# Altium project xDAC-v3.PrjPcb (part 2 of 7)

## Sheet iDAC2.SchDoc: Laser PCB
size A3; DrawnBy: James Singleton; Organization: TMC Technology Ltd.; DocumentNumber: 3; Revision: A; SheetNumber: 4; SheetTotal: 18; Drawn Date: 22/12/2020
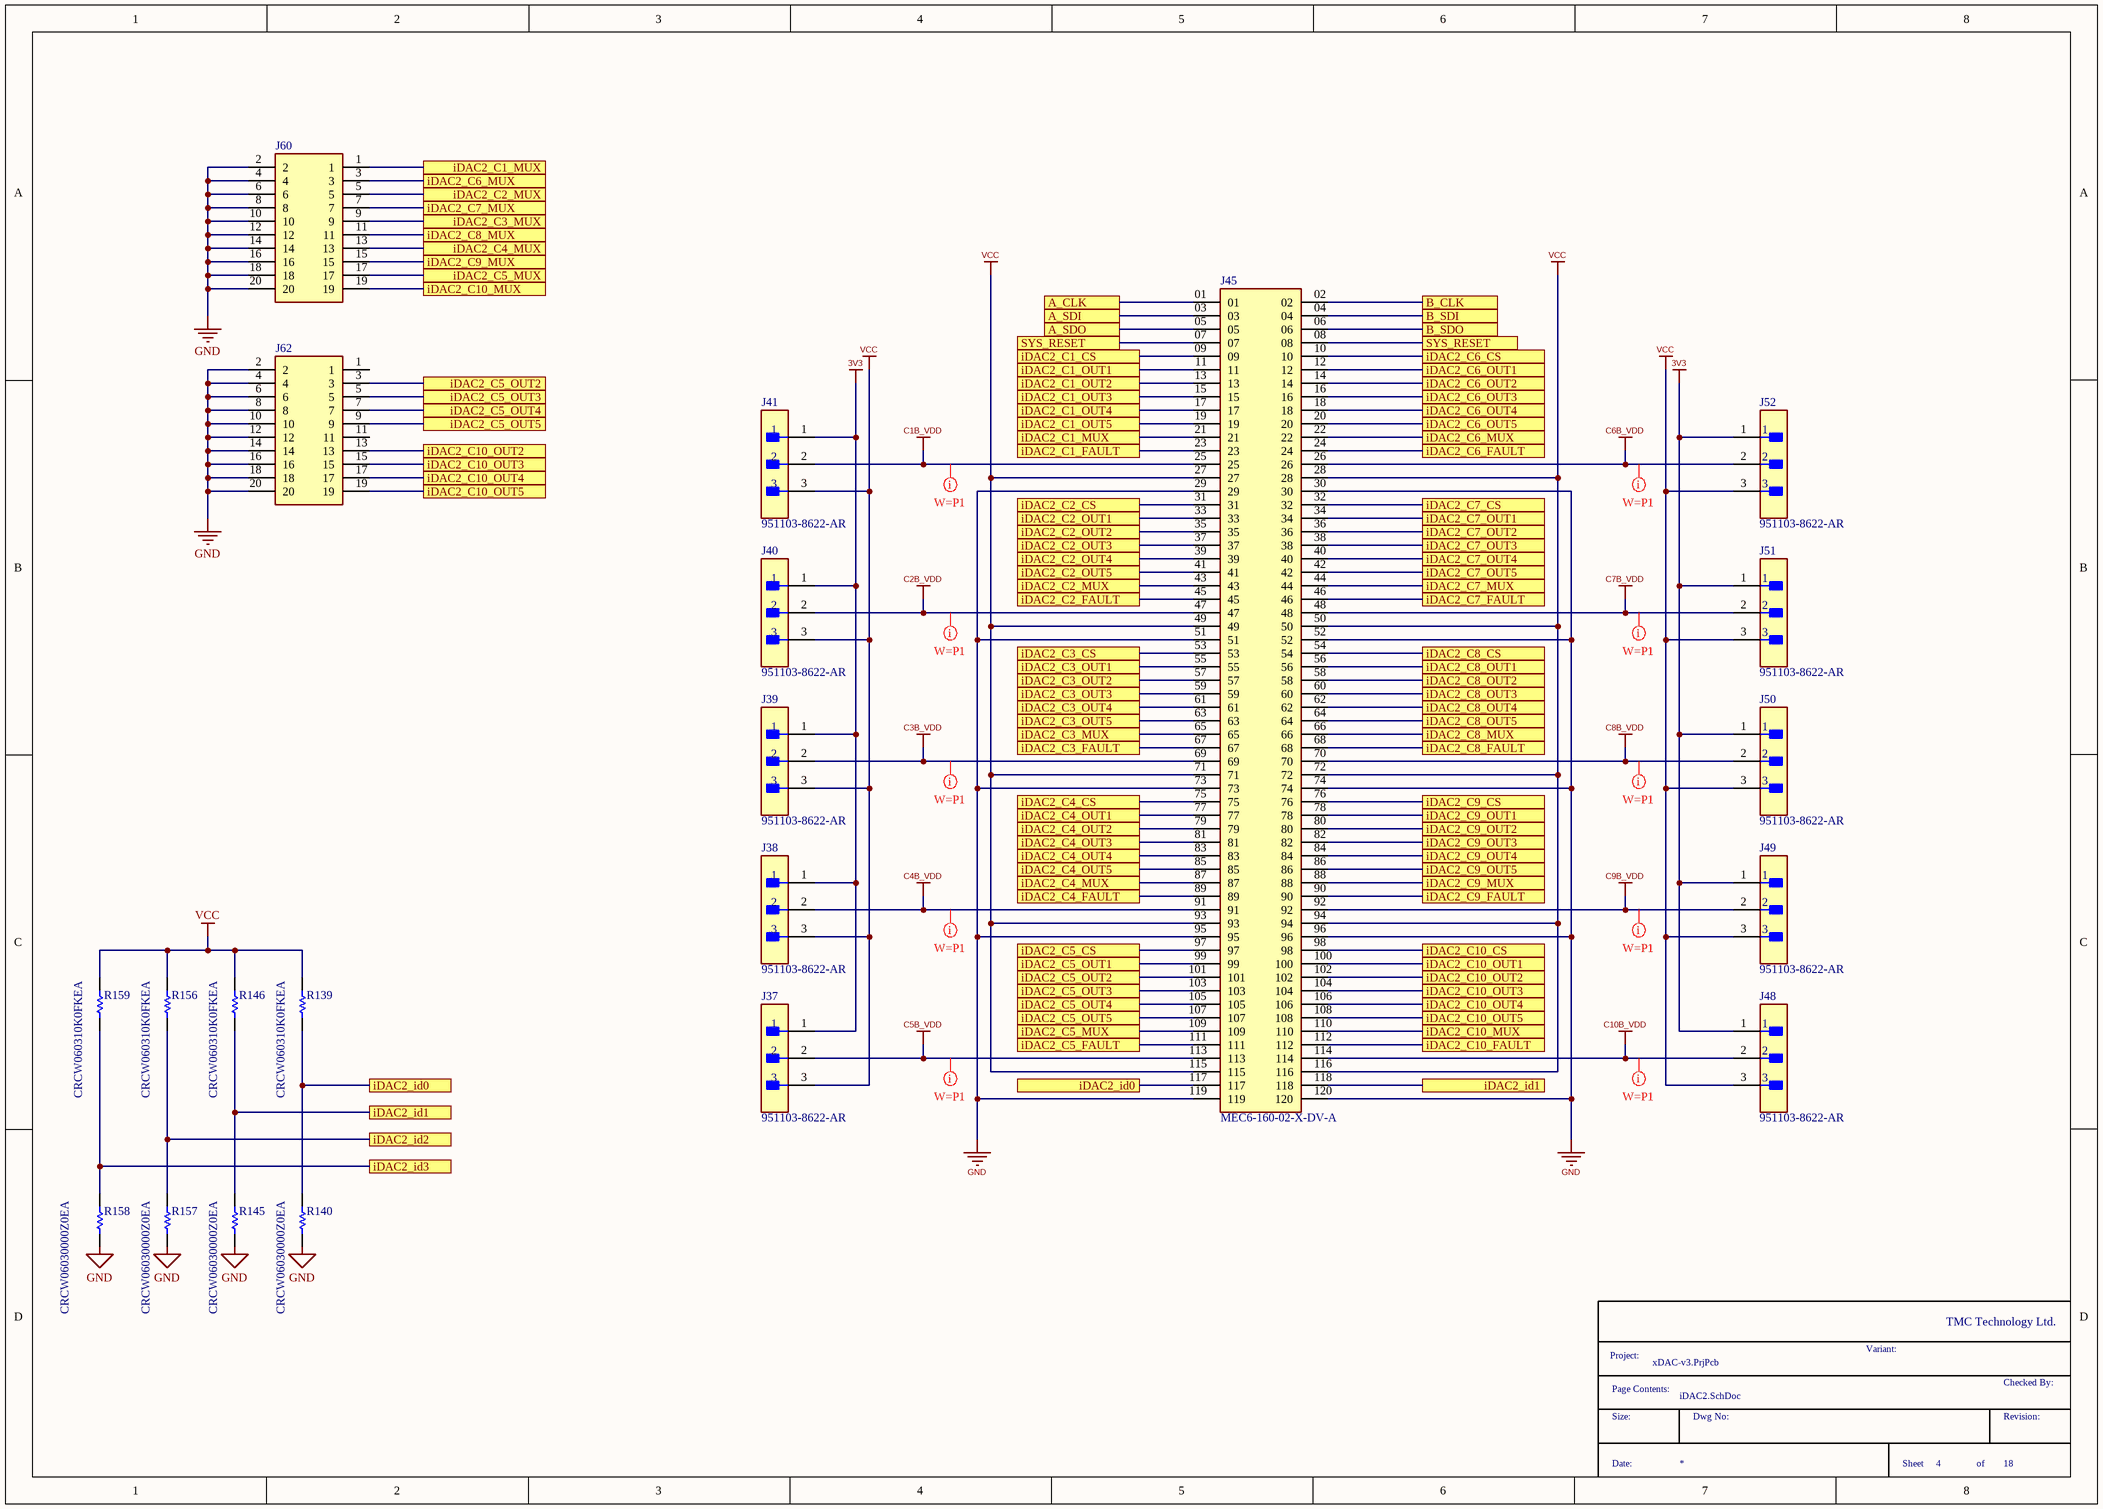
[diagram p4: iDAC2.SchDoc]

### Parts
J37  951103-8622-AR  [FP-951103-8622-AR-MFG]
J38  951103-8622-AR  [FP-951103-8622-AR-MFG]
J39  951103-8622-AR  [FP-951103-8622-AR-MFG]
J40  951103-8622-AR  [FP-951103-8622-AR-MFG]
J41  951103-8622-AR  [FP-951103-8622-AR-MFG]
J45  MEC6-160-02-X-DV-A  [SAMTEC_MEC6-160-02-X-DV-A]
J48  951103-8622-AR  [FP-951103-8622-AR-MFG]
J49  951103-8622-AR  [FP-951103-8622-AR-MFG]
J50  951103-8622-AR  [FP-951103-8622-AR-MFG]
J51  951103-8622-AR  [FP-951103-8622-AR-MFG]
J52  951103-8622-AR  [FP-951103-8622-AR-MFG]
J60  (no value)  [HDRV20W40P127_2X10_1270X340X550P]
J62  (no value)  [HDRV20W40P127_2X10_1270X340X550P]
R139  CRCW060310K0FKEA  [RESC1609X50X30NL8T20]
R140  CRCW06030000Z0EA  [RESC1609X50X30NL8T20]
R145  CRCW06030000Z0EA  [RESC1609X50X30NL8T20]
R146  CRCW060310K0FKEA  [RESC1609X50X30NL8T20]
R156  CRCW060310K0FKEA  [RESC1609X50X30NL8T20]
R157  CRCW06030000Z0EA  [RESC1609X50X30NL8T20]
R158  CRCW06030000Z0EA  [RESC1609X50X30NL8T20]
R159  CRCW060310K0FKEA  [RESC1609X50X30NL8T20]

### Ports
A_CLK (see iDAC1[4A], PI_INTERFACE[2B], vDAC1[4A], vDAC2[4A]), A_SDI (see iDAC1[4A], PI_INTERFACE[2B], vDAC1[4A], vDAC2[4A]), A_SDO (see iDAC1[4A], PI_INTERFACE[1B], vDAC1[4A], vDAC2[4A]), B_CLK (see iDAC1[6A], PI_INTERFACE[2B], vDAC1[5A], vDAC2[5A]), B_SDI (see iDAC1[6A], PI_INTERFACE[2B], vDAC1[5A], vDAC2[5A]), B_SDO (see iDAC1[6A], PI_INTERFACE[1B], vDAC1[5A], vDAC2[5A]), iDAC2_C1_CS (see ChipSelects+Faults[6B]), iDAC2_C1_FAULT (see ChipSelects+Faults[4B]), iDAC2_C1_MUX (see iDAC2[2A]), iDAC2_C1_MUX (see iDAC2[4B]), iDAC2_C1_OUT1 (see RX_FlexiConnectors[2C]), iDAC2_C1_OUT2 (see RX_FlexiConnectors[2C]), iDAC2_C1_OUT3 (see RX_FlexiConnectors[2C]), iDAC2_C1_OUT4 (see RX_FlexiConnectors[2C]), iDAC2_C1_OUT5 (see RX_FlexiConnectors[2C]), iDAC2_C2_CS (see ChipSelects+Faults[6B]), iDAC2_C2_FAULT (see ChipSelects+Faults[1B]), iDAC2_C2_MUX (see iDAC2[2A]), iDAC2_C2_MUX (see iDAC2[4B]), iDAC2_C2_OUT1 (see RX_FlexiConnectors[2C]), iDAC2_C2_OUT2 (see RX_FlexiConnectors[2C]), iDAC2_C2_OUT3 (see RX_FlexiConnectors[2C]), iDAC2_C2_OUT4 (see RX_FlexiConnectors[2C]), iDAC2_C2_OUT5 (see RX_FlexiConnectors[2C]), iDAC2_C3_CS (see ChipSelects+Faults[6C]), iDAC2_C3_FAULT (see ChipSelects+Faults[1B]), iDAC2_C3_MUX (see iDAC2[2A]), iDAC2_C3_MUX (see iDAC2[4B]), iDAC2_C3_OUT1 (see RX_FlexiConnectors[2C]), iDAC2_C3_OUT2 (see RX_FlexiConnectors[2C]), iDAC2_C3_OUT3 (see RX_FlexiConnectors[2C]), iDAC2_C3_OUT4 (see RX_FlexiConnectors[2C]), iDAC2_C3_OUT5 (see RX_FlexiConnectors[2C]), iDAC2_C4_CS (see ChipSelects+Faults[6C]), iDAC2_C4_FAULT (see ChipSelects+Faults[1B]), iDAC2_C4_MUX (see iDAC2[2A]), iDAC2_C4_MUX (see iDAC2[4C]), iDAC2_C4_OUT1 (see RX_FlexiConnectors[2C]), iDAC2_C4_OUT2 (see RX_FlexiConnectors[2C]), iDAC2_C4_OUT3 (see RX_FlexiConnectors[2B]), iDAC2_C4_OUT4 (see RX_FlexiConnectors[2B]), iDAC2_C4_OUT5 (see RX_FlexiConnectors[2B]), iDAC2_C5_CS (see ChipSelects+Faults[6C]), iDAC2_C5_FAULT (see ChipSelects+Faults[1C]), iDAC2_C5_MUX (see iDAC2[2A]), iDAC2_C5_MUX (see iDAC2[4C]), iDAC2_C5_OUT1 (see RX_FlexiConnectors[2B]), iDAC2_C5_OUT2 (see iDAC2[2B]), iDAC2_C5_OUT2 (see iDAC2[4C]), iDAC2_C5_OUT3 (see iDAC2[2B]), iDAC2_C5_OUT3 (see iDAC2[4C]), iDAC2_C5_OUT4 (see iDAC2[2B]), iDAC2_C5_OUT4 (see iDAC2[4C]), iDAC2_C5_OUT5 (see iDAC2[2B]), iDAC2_C5_OUT5 (see iDAC2[4C]), iDAC2_C6_CS (see ChipSelects+Faults[6C]), iDAC2_C6_FAULT (see ChipSelects+Faults[1C]), iDAC2_C6_MUX (see iDAC2[2A]), iDAC2_C6_MUX (see iDAC2[6B]), iDAC2_C6_OUT1 (see RX_FlexiConnectors[6C]), iDAC2_C6_OUT2 (see RX_FlexiConnectors[6C]), iDAC2_C6_OUT3 (see RX_FlexiConnectors[6C]), iDAC2_C6_OUT4 (see RX_FlexiConnectors[6C]), iDAC2_C6_OUT5 (see RX_FlexiConnectors[6C]), iDAC2_C7_CS (see ChipSelects+Faults[6C]), iDAC2_C7_FAULT (see ChipSelects+Faults[1C]), iDAC2_C7_MUX (see iDAC2[2A]), iDAC2_C7_MUX (see iDAC2[6B]), iDAC2_C7_OUT1 (see RX_FlexiConnectors[6C]), iDAC2_C7_OUT2 (see RX_FlexiConnectors[6C]), iDAC2_C7_OUT3 (see RX_FlexiConnectors[6C]), iDAC2_C7_OUT4 (see RX_FlexiConnectors[6C]), iDAC2_C7_OUT5 (see RX_FlexiConnectors[6C]), iDAC2_C8_CS (see ChipSelects+Faults[6C]), iDAC2_C8_FAULT (see ChipSelects+Faults[1C]), iDAC2_C8_MUX (see iDAC2[2A]), iDAC2_C8_MUX (see iDAC2[6B]), iDAC2_C8_OUT1 (see RX_FlexiConnectors[6C]), iDAC2_C8_OUT2 (see RX_FlexiConnectors[6C]), iDAC2_C8_OUT3 (see RX_FlexiConnectors[6C]), iDAC2_C8_OUT4 (see RX_FlexiConnectors[6C]), iDAC2_C8_OUT5 (see RX_FlexiConnectors[6C]), iDAC2_C9_CS (see ChipSelects+Faults[6C]), iDAC2_C9_FAULT (see ChipSelects+Faults[4C]), iDAC2_C9_MUX (see iDAC2[2A]), iDAC2_C9_MUX (see iDAC2[6C]), iDAC2_C9_OUT1 (see RX_FlexiConnectors[6C]), iDAC2_C9_OUT2 (see RX_FlexiConnectors[6C]), iDAC2_C9_OUT3 (see RX_FlexiConnectors[6B]), iDAC2_C9_OUT4 (see RX_FlexiConnectors[6B]), iDAC2_C9_OUT5 (see RX_FlexiConnectors[6B]), iDAC2_C10_CS (see ChipSelects+Faults[6C]), iDAC2_C10_FAULT (see ChipSelects+Faults[1C]), iDAC2_C10_MUX (see iDAC2[2A]), iDAC2_C10_MUX (see iDAC2[6C]), iDAC2_C10_OUT1 (see RX_FlexiConnectors[6B]), iDAC2_C10_OUT2 (see iDAC2[2B]), iDAC2_C10_OUT2 (see iDAC2[6C]), iDAC2_C10_OUT3 (see iDAC2[2B]), iDAC2_C10_OUT3 (see iDAC2[6C]), iDAC2_C10_OUT4 (see iDAC2[2B]), iDAC2_C10_OUT4 (see iDAC2[6C]), iDAC2_C10_OUT5 (see iDAC2[2B]), iDAC2_C10_OUT5 (see iDAC2[6C]), iDAC2_id0 (see ChipSelects+Faults[1C], iDAC2[2C]), iDAC2_id0 (see ChipSelects+Faults[1C], iDAC2[4C]), iDAC2_id1 (see iDAC2[2C]), iDAC2_id1 (see iDAC2[6C]), iDAC2_id2, iDAC2_id3, SYS_RESET (see iDAC1[4A], iDAC1[6A], iDAC2[4A], PI_INTERFACE[1C], PIO[5A], PIO[5D], PIO[7B], PIO[7C], vDAC1[4A], vDAC1[5A], vDAC2[3A], vDAC2[5A]), SYS_RESET (see iDAC1[4A], iDAC1[6A], iDAC2[6A], PI_INTERFACE[1C], PIO[5A], PIO[5D], PIO[7B], PIO[7C], vDAC1[4A], vDAC1[5A], vDAC2[3A], vDAC2[5A])

### Nets
3V3: J37.1 J38.1 J39.1 J40.1 J41.1 J48.1 J49.1 J50.1 J51.1 J52.1
C1B_VDD: J41.2 J45.25
C2B_VDD: J40.2 J45.47
C3B_VDD: J39.2 J45.69
C4B_VDD: J38.2 J45.91
C5B_VDD: J37.2 J45.113
C6B_VDD: J45.26 J52.2
C7B_VDD: J45.48 J51.2
C8B_VDD: J45.70 J50.2
C9B_VDD: J45.92 J49.2
C10B_VDD: J45.114 J48.2
GND: J45.29 J45.30 J45.51 J45.52 J45.73 J45.74 J45.95 J45.96 J45.119 J45.120 J60.2 J60.4 J60.6 J60.8 J60.10 J60.12 J60.14 J60.16 J60.18 J60.20 J62.2 J62.4 J62.6 J62.8 J62.10 J62.12 J62.14 J62.16 J62.18 J62.20 R140.1 R145.1 R157.1 R158.1
VCC: J37.3 J38.3 J39.3 J40.3 J41.3 J45.27 J45.28 J45.49 J45.50 J45.71 J45.72 J45.93 J45.94 J45.115 J45.116 J48.3 J49.3 J50.3 J51.3 J52.3 R139.2 R146.2 R156.2 R159.2
A_CLK: J45.01 ; port A_CLK
A_SDI: J45.03 ; port A_SDI
A_SDO: J45.05 ; port A_SDO
B_CLK: J45.02 ; port B_CLK
B_SDI: J45.04 ; port B_SDI
B_SDO: J45.06 ; port B_SDO
iDAC2_C1_CS: J45.09 ; port iDAC2_C1_CS
iDAC2_C1_FAULT: J45.23 ; port iDAC2_C1_FAULT
iDAC2_C1_MUX: J45.21 J60.1 ; port iDAC2_C1_MUX
iDAC2_C1_OUT1: J45.11 ; port iDAC2_C1_OUT1
iDAC2_C1_OUT2: J45.13 ; port iDAC2_C1_OUT2
iDAC2_C1_OUT3: J45.15 ; port iDAC2_C1_OUT3
iDAC2_C1_OUT4: J45.17 ; port iDAC2_C1_OUT4
iDAC2_C1_OUT5: J45.19 ; port iDAC2_C1_OUT5
iDAC2_C2_CS: J45.31 ; port iDAC2_C2_CS
iDAC2_C2_FAULT: J45.45 ; port iDAC2_C2_FAULT
iDAC2_C2_MUX: J45.43 J60.5 ; port iDAC2_C2_MUX
iDAC2_C2_OUT1: J45.33 ; port iDAC2_C2_OUT1
iDAC2_C2_OUT2: J45.35 ; port iDAC2_C2_OUT2
iDAC2_C2_OUT3: J45.37 ; port iDAC2_C2_OUT3
iDAC2_C2_OUT4: J45.39 ; port iDAC2_C2_OUT4
iDAC2_C2_OUT5: J45.41 ; port iDAC2_C2_OUT5
iDAC2_C3_CS: J45.53 ; port iDAC2_C3_CS
iDAC2_C3_FAULT: J45.67 ; port iDAC2_C3_FAULT
iDAC2_C3_MUX: J45.65 J60.9 ; port iDAC2_C3_MUX
iDAC2_C3_OUT1: J45.55 ; port iDAC2_C3_OUT1
iDAC2_C3_OUT2: J45.57 ; port iDAC2_C3_OUT2
iDAC2_C3_OUT3: J45.59 ; port iDAC2_C3_OUT3
iDAC2_C3_OUT4: J45.61 ; port iDAC2_C3_OUT4
iDAC2_C3_OUT5: J45.63 ; port iDAC2_C3_OUT5
iDAC2_C4_CS: J45.75 ; port iDAC2_C4_CS
iDAC2_C4_FAULT: J45.89 ; port iDAC2_C4_FAULT
iDAC2_C4_MUX: J45.87 J60.13 ; port iDAC2_C4_MUX
iDAC2_C4_OUT1: J45.77 ; port iDAC2_C4_OUT1
iDAC2_C4_OUT2: J45.79 ; port iDAC2_C4_OUT2
iDAC2_C4_OUT3: J45.81 ; port iDAC2_C4_OUT3
iDAC2_C4_OUT4: J45.83 ; port iDAC2_C4_OUT4
iDAC2_C4_OUT5: J45.85 ; port iDAC2_C4_OUT5
iDAC2_C5_CS: J45.97 ; port iDAC2_C5_CS
iDAC2_C5_FAULT: J45.111 ; port iDAC2_C5_FAULT
iDAC2_C5_MUX: J45.109 J60.17 ; port iDAC2_C5_MUX
iDAC2_C5_OUT1: J45.99 ; port iDAC2_C5_OUT1
iDAC2_C5_OUT2: J45.101 J62.3 ; port iDAC2_C5_OUT2
iDAC2_C5_OUT3: J45.103 J62.5 ; port iDAC2_C5_OUT3
iDAC2_C5_OUT4: J45.105 J62.7 ; port iDAC2_C5_OUT4
iDAC2_C5_OUT5: J45.107 J62.9 ; port iDAC2_C5_OUT5
iDAC2_C6_CS: J45.10 ; port iDAC2_C6_CS
iDAC2_C6_FAULT: J45.24 ; port iDAC2_C6_FAULT
iDAC2_C6_MUX: J45.22 J60.3 ; port iDAC2_C6_MUX
iDAC2_C6_OUT1: J45.12 ; port iDAC2_C6_OUT1
iDAC2_C6_OUT2: J45.14 ; port iDAC2_C6_OUT2
iDAC2_C6_OUT3: J45.16 ; port iDAC2_C6_OUT3
iDAC2_C6_OUT4: J45.18 ; port iDAC2_C6_OUT4
iDAC2_C6_OUT5: J45.20 ; port iDAC2_C6_OUT5
iDAC2_C7_CS: J45.32 ; port iDAC2_C7_CS
iDAC2_C7_FAULT: J45.46 ; port iDAC2_C7_FAULT
iDAC2_C7_MUX: J45.44 J60.7 ; port iDAC2_C7_MUX
iDAC2_C7_OUT1: J45.34 ; port iDAC2_C7_OUT1
iDAC2_C7_OUT2: J45.36 ; port iDAC2_C7_OUT2
iDAC2_C7_OUT3: J45.38 ; port iDAC2_C7_OUT3
iDAC2_C7_OUT4: J45.40 ; port iDAC2_C7_OUT4
iDAC2_C7_OUT5: J45.42 ; port iDAC2_C7_OUT5
iDAC2_C8_CS: J45.54 ; port iDAC2_C8_CS
iDAC2_C8_FAULT: J45.68 ; port iDAC2_C8_FAULT
iDAC2_C8_MUX: J45.66 J60.11 ; port iDAC2_C8_MUX
iDAC2_C8_OUT1: J45.56 ; port iDAC2_C8_OUT1
iDAC2_C8_OUT2: J45.58 ; port iDAC2_C8_OUT2
iDAC2_C8_OUT3: J45.60 ; port iDAC2_C8_OUT3
iDAC2_C8_OUT4: J45.62 ; port iDAC2_C8_OUT4
iDAC2_C8_OUT5: J45.64 ; port iDAC2_C8_OUT5
iDAC2_C9_CS: J45.76 ; port iDAC2_C9_CS
iDAC2_C9_FAULT: J45.90 ; port iDAC2_C9_FAULT
iDAC2_C9_MUX: J45.88 J60.15 ; port iDAC2_C9_MUX
iDAC2_C9_OUT1: J45.78 ; port iDAC2_C9_OUT1
iDAC2_C9_OUT2: J45.80 ; port iDAC2_C9_OUT2
iDAC2_C9_OUT3: J45.82 ; port iDAC2_C9_OUT3
iDAC2_C9_OUT4: J45.84 ; port iDAC2_C9_OUT4
iDAC2_C9_OUT5: J45.86 ; port iDAC2_C9_OUT5
iDAC2_C10_CS: J45.98 ; port iDAC2_C10_CS
iDAC2_C10_FAULT: J45.112 ; port iDAC2_C10_FAULT
iDAC2_C10_MUX: J45.110 J60.19 ; port iDAC2_C10_MUX
iDAC2_C10_OUT1: J45.100 ; port iDAC2_C10_OUT1
iDAC2_C10_OUT2: J45.102 J62.13 ; port iDAC2_C10_OUT2
iDAC2_C10_OUT3: J45.104 J62.15 ; port iDAC2_C10_OUT3
iDAC2_C10_OUT4: J45.106 J62.17 ; port iDAC2_C10_OUT4
iDAC2_C10_OUT5: J45.108 J62.19 ; port iDAC2_C10_OUT5
iDAC2_id0: J45.117 R139.1 R140.2 ; port iDAC2_id0
iDAC2_id1: J45.118 R145.2 R146.1 ; port iDAC2_id1
iDAC2_id2: R156.1 R157.2 ; port iDAC2_id2
iDAC2_id3: R158.2 R159.1 ; port iDAC2_id3
SYS_RESET: J45.07 J45.08 ; port SYS_RESET

Not connected (* = marked no-connect by the designer): J62 1 11

### Layout directives
mark named W=P1: C1B_VDD, C2B_VDD, C3B_VDD, C4B_VDD, C5B_VDD, C6B_VDD, C7B_VDD, C8B_VDD, C9B_VDD, C10B_VDD

### Notes on the sheet
- TMC Technology Ltd.
- Page Contents:
- Project:
- Variant:
- Checked By:
- Size:
- Date:
- Dwg No:
- Sheet
- of
- Revision:

### Library data of the parts
J37-J41 J48-J52 = CMP-05379-000003-1: as J25 on sheet iDAC1; Height: 6.3mm; Digikey Description: CONN HEADER VERT 3POS 2MM; Device Class L3: unset; Category: Conn; Manufacturer Part Number: 951103-8622-AR; RoHS: TRUE; Contact Material: Gold,Nickel; ComponentLink2Description: Datasheet; Temperature Range Low: -55°C; Device Class L1: Connectors; Pitch: 2mm; Mouser Description: Header; PinStrip; CopperAlloy; HighTempThermoplastic; 3Cnts; 1A; RtAngle; 951Series; Octopart: https://octopart.com/951103-8622-ar-3m-14400669; Package: 951103-8622-AR; Lead Free: Yes; Device Class L2: Headers and Wire Housings; Temperature Range High: +125°C; ComponentLink2URL: http://multimedia.3m.com/mws/media/1400506O/3m-pin-strip-header-951-series-78-5100-2653-3.pdf; Automotive: No; Temperature: -55°C to +125°C; Number Of Rows: 1
J45 = MEC6-160-02-X-DV-A: MF: Samtec Inc.; System: Connector; Value: *; Price: None; Package: None; Availability: Unavailable; MP: MEC6-160-02-X-DV-A
J60 J62 = 20021111-00020T4LF: Connector; Manufacturer_Name: FCI Electronics; Datasheet Link: https://media.digikey.com/pdf/Data%20Sheets/FCI%20PDFs/Minitek%20127_Catalog.pdf; Height: 5.5mm; Manufacturer_Part_Number: 20021111-00020T4LF
R139 R146 R156 R159 = CMP-1666-00005-4: Chip Resistor, 10 KOhm, +/- 1%, 100 mW, -55 to 155 degC, 0603 (1608 Metric), RoHS, Tape and Reel; Manufacturer: Vishay Semiconductor; Voltage Rating: 75 V; Max Operating Temperature: 155 degC; PackageDescription: 2-Pin Surface Mount Device, Body 1.575 x 0.85 mm; ComponentLink1Description: Manufacturer URL; RoHSCompliant: true; PackageReference: 0603; REACH SVHC: Unknown; Length: 1.55 mm; DatasheetVersion: 06/2012; Packaging: Tape and Reel; Min Operating Temperature: -55 degC; Mounting Technology: Surface Mount; ComponentLink2URL: https://datasheet.ciiva.com/11809/0900766b80d98afc-11809037.pdf; Height: 0.45 mm; ComponentLink2Description: Datasheet; Package Quantity: 5000; ComponentLink1URL: http://www.vishay.com/
R140 R145 R157 R158 = CMP-2000-03816-5: Chip Resistor, 0 Ohm, Jumper, 100 mW, -55 to 155 degC, 0603 (1608 Metric), RoHS, Tape and Reel; Manufacturer: Vishay Semiconductor; Voltage Rating: 75 V; Package Quantity: 5000; DatasheetVersion: 06/2012; Min Operating Temperature: -55 degC; ComponentLink1URL: http://www.vishay.com/; Mounting Technology: Surface Mount; Height: 0.45 mm; ComponentLink1Description: Manufacturer URL; REACH SVHC: Unknown; PackageReference: 0603; Packaging: Tape and Reel; Max Operating Temperature: 155 degC; Mount: Surface Mount; ComponentLink2Description: Datasheet; PackageDescription: 2-Pin Surface Mount Device, Body 1.575 x 0.85 mm; Length: 1.55 mm; ComponentLink2URL: http://www.vishay.com/docs/20035/dcrcwe3.pdf; Pins: 2; RoHSCompliant: true

## Sheet LIM+LEDS+POWER.SchDoc: Laser PCB
size A3; DrawnBy: James Singleton; Organization: TMC Technology Ltd.; DocumentNumber: 5; Revision: A; SheetNumber: 5; SheetTotal: 18; Drawn Date: 22/12/2020
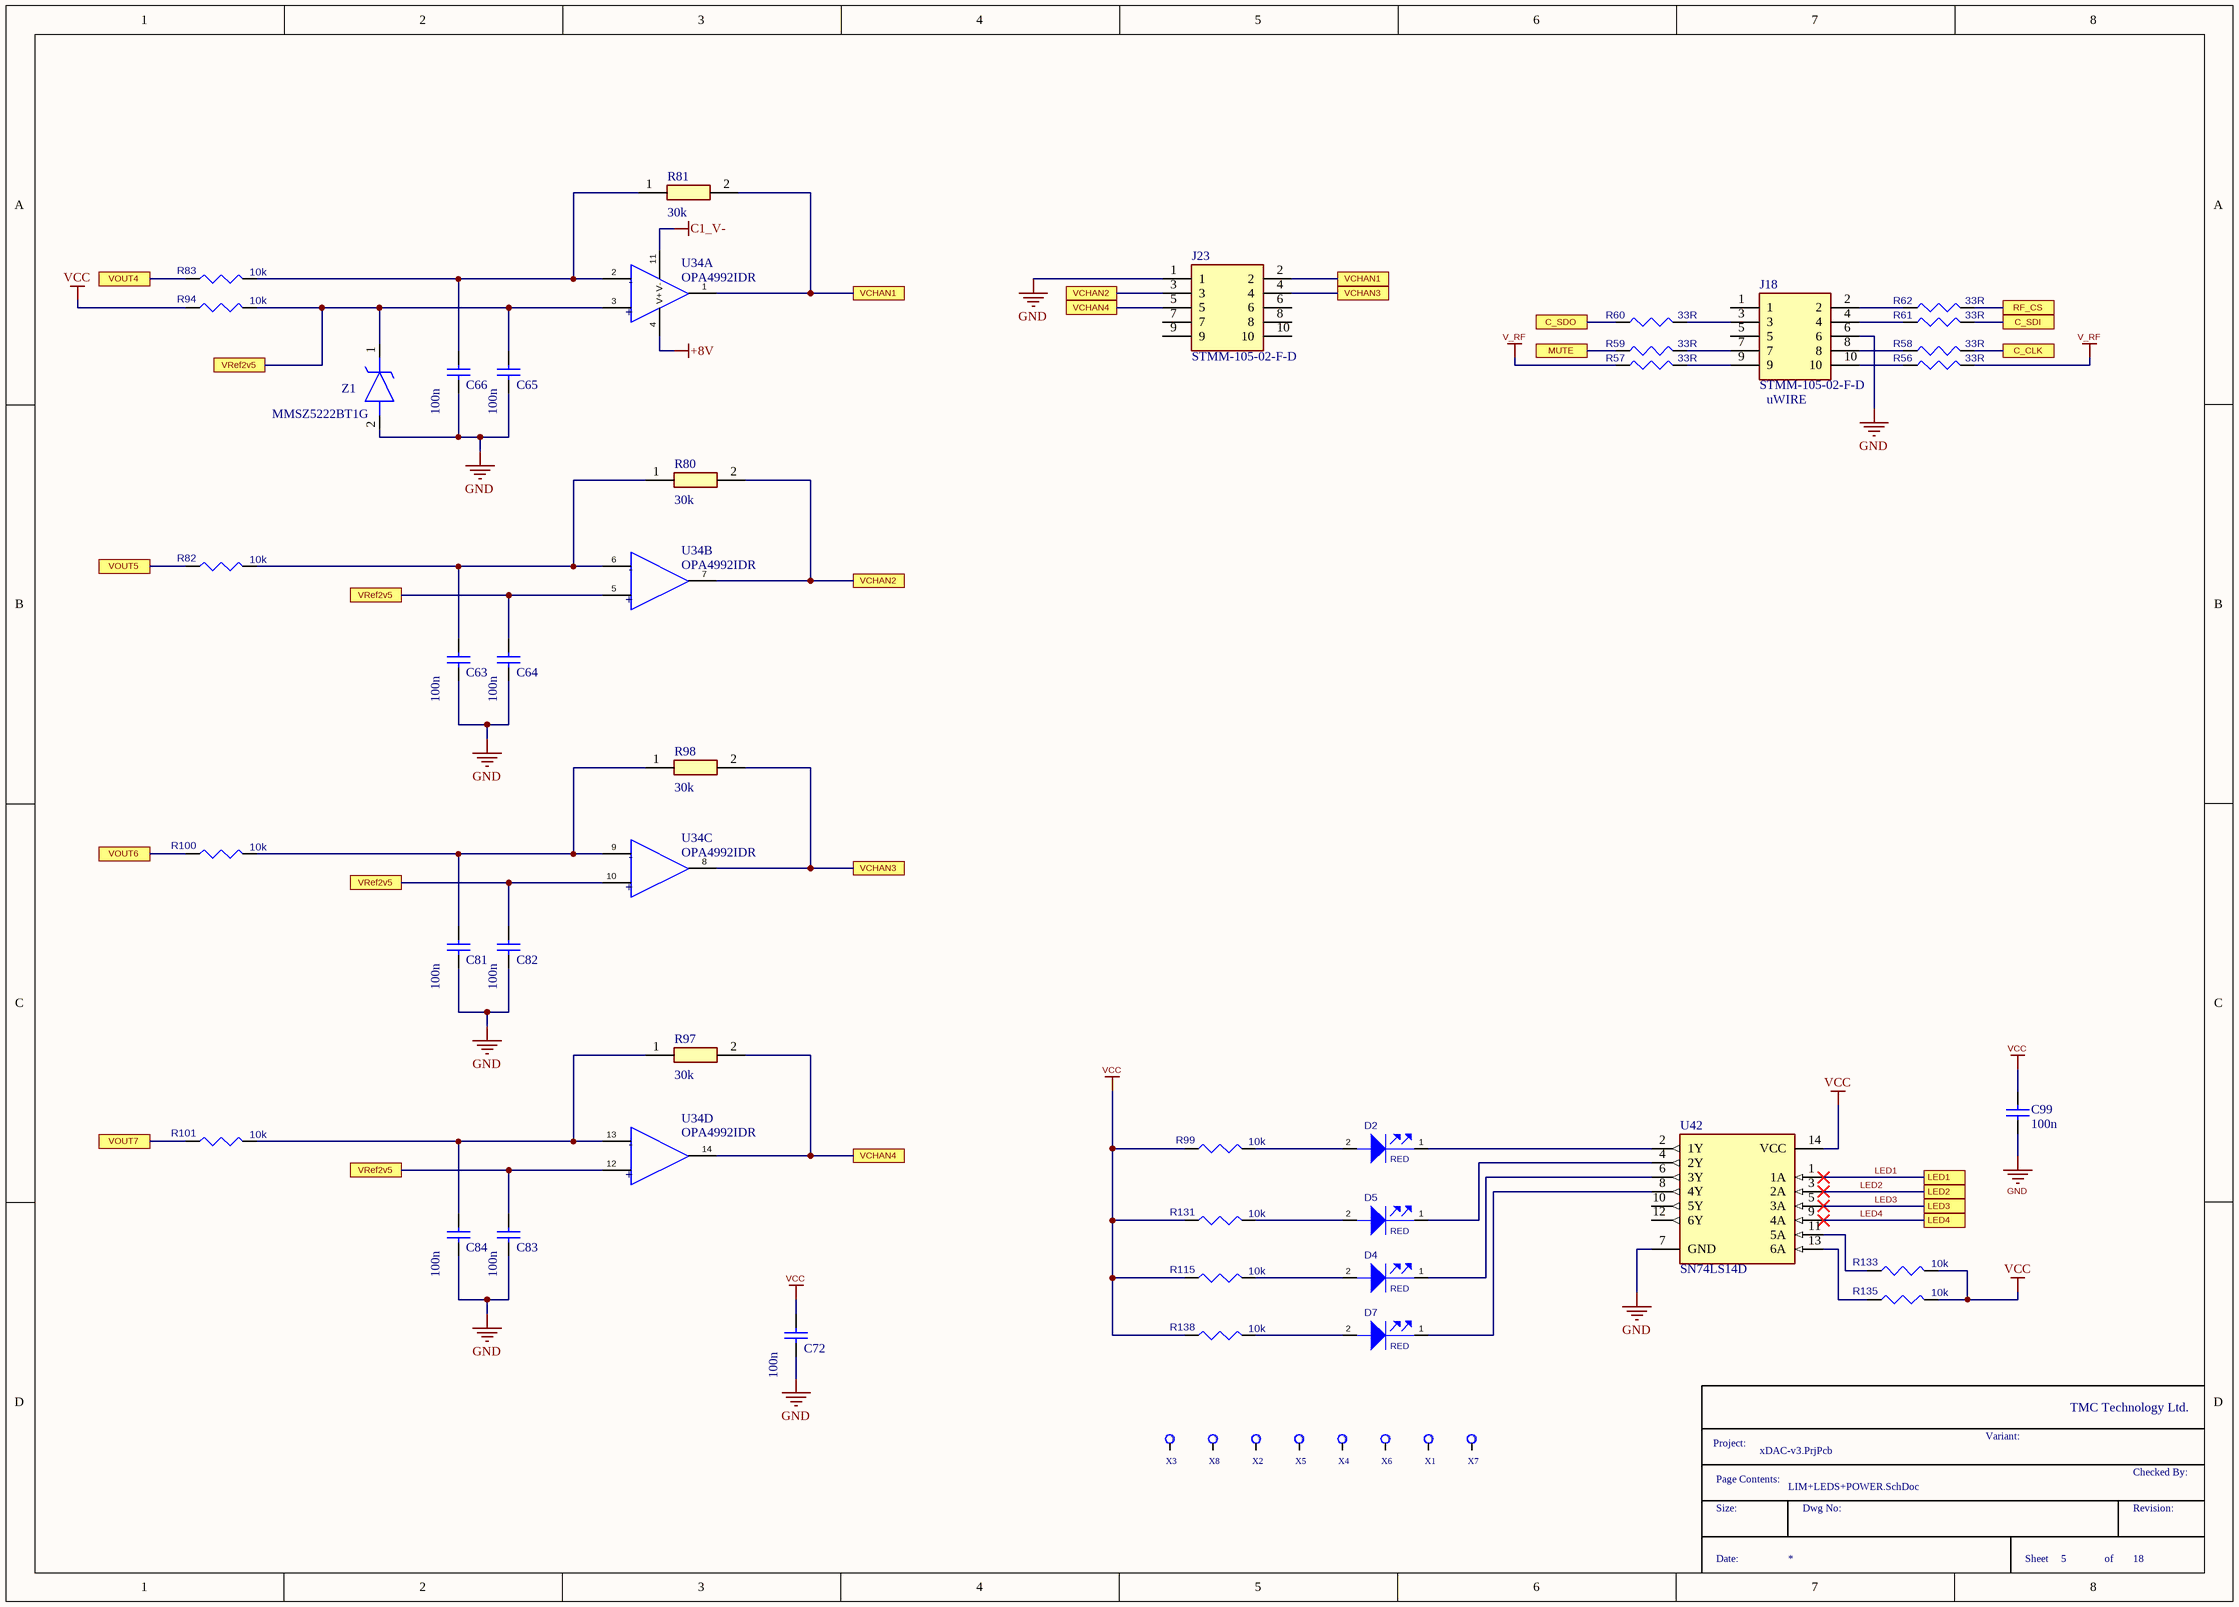
[diagram p5: LIM+LEDS+POWER.SchDoc]

### Parts
C63  100n  [CAPC1608X90X35LL15T15]
C64  100n  [CAPC1608X90X35LL15T15]
C65  100n  [CAPC1608X90X35LL15T15]
C66  100n  [CAPC1608X90X35LL15T15]
C72  100n  [CAPC1608X90X35LL15T15]
C81  100n  [CAPC1608X90X35LL15T15]
C82  100n  [CAPC1608X90X35LL15T15]
C83  100n  [CAPC1608X90X35LL15T15]
C84  100n  [CAPC1608X90X35LL15T15]
C99  100n  [CAPC1608X90X35LL15T15]
D2  value RED  [LED$2F$RA]  (hidden comment: LED)
D4  value RED  [LED$2F$RA]  (hidden comment: LED)
D5  value RED  [LED$2F$RA]  (hidden comment: LED)
D7  value RED  [LED$2F$RA]  (hidden comment: LED)
J18  STMM-105-02-F-D  value uWIRE  [STMM-105-XX-YY-D]
J23  STMM-105-02-F-D  [STMM-105-XX-YY-D]
R56  value 33R  [CR0603N]  (hidden comment: RES)
R57  value 33R  [CR0603N]  (hidden comment: RES)
R58  value 33R  [CR0603N]  (hidden comment: RES)
R59  value 33R  [CR0603N]  (hidden comment: RES)
R60  value 33R  [CR0603N]  (hidden comment: RES)
R61  value 33R  [CR0603N]  (hidden comment: RES)
R62  value 33R  [CR0603N]  (hidden comment: RES)
R80  value 30k  [ERJS03J155V]  (hidden comment: ERJ-U03F3002V)
R81  value 30k  [ERJS03J155V]  (hidden comment: ERJ-U03F3002V)
R82  value 10k  [CR0603N]  (hidden comment: RES)
R83  value 10k  [CR0603N]  (hidden comment: RES)
R94  value 10k  [CR0603N]  (hidden comment: RES)
R97  value 30k  [ERJS03J155V]  (hidden comment: ERJ-U03F3002V)
R98  value 30k  [ERJS03J155V]  (hidden comment: ERJ-U03F3002V)
R99  value 10k  [CR0603N]  (hidden comment: RES)
R100  value 10k  [CR0603N]  (hidden comment: RES)
R101  value 10k  [CR0603N]  (hidden comment: RES)
R115  value 10k  [CR0603N]  (hidden comment: RES)
R131  value 10k  [CR0603N]  (hidden comment: RES)
R133  value 10k  [CR0603N]  (hidden comment: RES)
R135  value 10k  [CR0603N]  (hidden comment: RES)
R138  value 10k  [CR0603N]  (hidden comment: RES)
U34  OPA4992IDR  [SOIC127P600X175-14N]  (parts A,B,C,D of 4)
U42  SN74LS14D  [FP-D0014A-MFG]
X1  MTG3MM  [MTG3MM]  (value not drawn)
X2  MTG3MM  [MTG3MM]  (value not drawn)
X3  MTG3MM  [MTG3MM]  (value not drawn)
X4  MTG3MM  [MTG3MM]  (value not drawn)
X5  MTG3MM  [MTG3MM]  (value not drawn)
X6  MTG3MM  [MTG3MM]  (value not drawn)
X7  MTG3MM  [MTG3MM]  (value not drawn)
X8  MTG3MM  [MTG3MM]  (value not drawn)
Z1  MMSZ5222BT1G  [SOD3716X135N]

### Ports
C_CLK (see ChipSelects+Faults[4A], ChipSelects+Faults[4B], ChipSelects+Faults[4C], ChipSelects+Faults[4D], PI_INTERFACE[1B], PI_INTERFACE[4C], PIO[3B], PIO[3D], PIO[6B], PIO[6C]), C_SDI (see ChipSelects+Faults[4D], PI_INTERFACE[1B], PI_INTERFACE[4C], PIO[3B], PIO[3D], PIO[6B], PIO[6C]), C_SDO (see PI_INTERFACE[2B], PI_INTERFACE[4C], PIO[3B], PIO[3D], PIO[6B], PIO[6C]), LED1 (see PIO[6B]), LED2 (see PIO[6C]), LED3 (see PIO[6C]), LED4 (see PIO[6C]), MUTE (see PIO[3A]), RF_CS (see ChipSelects+Faults[6C]), VCHAN1 (see LIM+LEDS+POWER[4A]), VCHAN1 (see LIM+LEDS+POWER[5A]), VCHAN2 (see LIM+LEDS+POWER[4A]), VCHAN2 (see LIM+LEDS+POWER[4B]), VCHAN3 (see LIM+LEDS+POWER[4C]), VCHAN3 (see LIM+LEDS+POWER[5A]), VCHAN4 (see LIM+LEDS+POWER[4A]), VCHAN4 (see LIM+LEDS+POWER[4C]), VOUT4 (see TEC_CONTROLLER_1[8B]), VOUT5 (see TEC_CONTROLLER_1[8B]), VOUT6 (see TEC_CONTROLLER_1[8B]), VOUT7 (see TEC_CONTROLLER_1[8B]), VRef2v5 (see LIM+LEDS+POWER[1A], LIM+LEDS+POWER[2B], LIM+LEDS+POWER[2C]), VRef2v5 (see LIM+LEDS+POWER[1A], LIM+LEDS+POWER[2C]), VRef2v5 (see LIM+LEDS+POWER[2B], LIM+LEDS+POWER[2C])

### Nets
+8V: U34.4(V+)
C1_V-: U34.11(V-)
GND: C63.2 C64.2 C65.2 C66.2 C72.2 C81.2 C82.2 C83.2 C84.2 C99.2 J18.6 J23.1 U42.7(GND) Z1.2(A)
V_RF: R56.2 R57.1
VCC: C72.1 C99.1 R94.1 R99.1 R115.1 R131.1 R133.2 R135.2 R138.1 U42.14(VCC)
C_CLK: R58.2 ; port C_CLK
C_SDI: R61.2 ; port C_SDI
C_SDO: R60.1 ; port C_SDO
LED1: U42.1(1A) ; port LED1
LED2: U42.3(2A) ; port LED2
LED3: U42.5(3A) ; port LED3
LED4: U42.9(4A) ; port LED4
MUTE: R59.1 ; port MUTE
RF_CS: R62.2 ; port RF_CS
VCHAN1: J23.2 R81.2 U34.1 ; port VCHAN1
VCHAN2: J23.3 R80.2 U34.7 ; port VCHAN2
VCHAN3: J23.4 R98.2 U34.8 ; port VCHAN3
VCHAN4: J23.5 R97.2 U34.14 ; port VCHAN4
VOUT4: R83.1 ; port VOUT4
VOUT5: R82.1 ; port VOUT5
VOUT6: R100.1 ; port VOUT6
VOUT7: R101.1 ; port VOUT7
VRef2v5: C64.1 C65.1 C82.1 C83.1 R94.2 U34.3 U34.5 U34.10 U34.12 Z1.1(K) ; port VRef2v5
NetC63_1: C63.1 R80.1 R82.2 U34.6
NetC66_1: C66.1 R81.1 R83.2 U34.2
NetC81_1: C81.1 R98.1 R100.2 U34.9
NetC84_1: C84.1 R97.1 R101.2 U34.13
NetD2_1: D2.1(CATHODE) U42.2(1Y)
NetD2_2: D2.2(ANODE) R99.2
NetD4_1: D4.1(CATHODE) U42.6(3Y)
NetD4_2: D4.2(ANODE) R115.2
NetD5_1: D5.1(CATHODE) U42.4(2Y)
NetD5_2: D5.2(ANODE) R131.2
NetD7_1: D7.1(CATHODE) U42.8(4Y)
NetD7_2: D7.2(ANODE) R138.2
NetJ18_2: J18.2 R62.1
NetJ18_3: J18.3 R60.2
NetJ18_4: J18.4 R61.1
NetJ18_7: J18.7 R59.2
NetJ18_8: J18.8 R58.1
NetJ18_9: J18.9 R57.2
NetJ18_10: J18.10 R56.1
NetR133_1: R133.1 U42.11(5A)
NetR135_1: R135.1 U42.13(6A)

Not connected (* = marked no-connect by the designer): J18 1 5; J23 6 7 8 9 10; U42 10(5Y) 12(6Y); X1 1; X2 1; X3 1; X4 1; X5 1; X6 1; X7 1; X8 1

### Notes on the sheet
- TMC Technology Ltd.
- Page Contents:
- Project:
- Variant:
- Checked By:
- Size:
- Date:
- Dwg No:
- Sheet
- of
- Revision:
- (in symbol MTG3MM) T
- (in symbol OPA4992IDR, part A) -; +
- (in symbol OPA4992IDR, part B) -; +
- (in symbol OPA4992IDR, part C) -; +
- (in symbol OPA4992IDR, part D) -; +

### Library data of the parts
C63-C66 C72 C81-C84 C99 = CMP-1035-02592-3: as C50 on sheet ChipSelects+Faults; Pins: 2; Max Operating Temperature: 125 degC; Min Operating Temperature: -55 degC; Case Code (Imperial): 0603; DatasheetVersion: 07/2016; Package Quantity: 4000; Length: 1.6 mm; REACH SVHC: No SVHC; Packaging: Tape and Reel; Case Code (Metric): 1608; Mounting Technology: Surface Mount; RoHSCompliant: true; Height: 0.9 mm; ComponentLink1URL: http://www.avx.com/; ComponentLink2URL: http://datasheets.avx.com/X7RDielectric.pdf; Mount: Surface Mount; ComponentLink2Description: Datasheet; Width: 0.81 mm; PackageReference: 0603; PackageDescription: 2-Pin Surface Mount Device, Body 1.6 x 0.81 mm; Radiation Hardening: No; ComponentLink1Description: Manufacturer URL; Voltage Rating (DC): 50 V; Tolerance: 10%; 8Vinv: *
D2 D4 D5 D7 = LED: LED,RED,WATERCLEAR,TH RA; Manufacturer: BROADCOM; Part No: HLMP-3301-F00B2; Source_Path: \\MIL-NS1\CIP\SCHEMATIC_SYMBOLS\LTC_DIODE.OLB; CLASS: DISCRETE; PCB DECAL: LED/RA; Order No: 1003372; Package_Type: TH RA
J18 J23 = STMM-105-02-F-D: Connector; Manufacturer_Name: SAMTEC; Datasheet Link: http://suddendocs.samtec.com/prints/stmm-1xx-xx-xx-d-xx-xx-mkt1.pdf; Manufacturer_Part_Number: STMM-105-02-F-D; Mouser Part Number: 200-STMM10502FD; Mouser Price/Stock: https://www.mouser.co.uk/ProductDetail/Samtec/STMM-105-02-F-D?qs=rU5fayqh%252BE2wrlyAPVJOww%3D%3D
R56-R62 R82 R83 R94 R99-R101 R115 R131 R133 R135 R138 = RES: as R51 on sheet ChipSelects+Faults; PCB DECAL: CR0603N; Rated_Power: 1/10W; Tolerance: 1%; Package_Size: 0603
R80 R81 R97 R98 = ERJ-U03F3002V: Resistor; Manufacturer_Name: Panasonic; Datasheet Link: http://industrial.panasonic.com/cdbs/www-data/pdf/RDP0000/AOA0000C334.pdf; Height: 0.55mm; Manufacturer_Part_Number: ERJ-U03F3002V
U34 = OPA4992IDR: Integrated Circuit; Manufacturer_Name: Texas Instruments; Datasheet Link: https://www.ti.com/lit/ds/symlink/opa4992.pdf?ts=1675242172538&ref_url=https%253A%252F%252Fwww.ti.com%252Fproduct%252FOPA4992%252Fpart-details%252FOPA4992IDR; Height: 1.75mm; Manufacturer_Part_Number: OPA4992IDR; Mouser Part Number: 595-OPA4992IDR; Mouser Price/Stock: https://www.mouser.co.uk/ProductDetail/Texas-Instruments/OPA4992IDR?qs=doiCPypUmgFQGotnV4iSxA%3D%3D; Arrow Part Number: OPA4992IDR; Arrow Price/Stock: https://www.arrow.com/en/products/opa4992idr/texas-instruments?region=nac
U42 = CMP-1615-00144-4: IC INVERTER SCHMITT 6CH 14SOIC; Manufacturer: Texas Instruments; Propagation Delay: 15ns; Number Of Circuits: 6; Number Of Inputs: 1; Max Supply Voltage: 5.25V; Logic Function Desc: Schmitt Trigger; Max Junction Temp: +150°C; Standoff Height: 0.1mm; Min Supply Voltage: 4.75V; Lead Free: Yes; Category: IC; Height: 1.75mm; Ambient Temperature Range Low: 0°C; Octopart: https://octopart.com/sn74ls14d-texas+instruments-464458; Device Class L1: Integrated Circuits (ICs); Digikey Description: IC INVERTER SCHMITT 6CH 14SOIC; Manufacturer Part Number: SN74LS14D; Ambient Temperature Range High: +70°C; Device Class L2: Logic ICs; ComponentLink2Description: Datasheet; Device Class L3: Logic Gates; Temperature Range High: +70°C; ComponentLink2URL: http://www.ti.com/lit/ds/symlink/sn74ls14.pdf; Number Of Outputs: 1; Temperature: 0°C to +70°C; RoHS: TRUE; Mouser Description: Inverters Hex Schmitt-Trigger; Temperature Range Low: 0°C; Package: D0014A; Automotive: No
X1-X8 = MTG3MM: .128 MOUNTING HOLE / .250 PAD; Part Number: MTHOLE1; Fitted: No; Value: DNF; PCB DECAL: MTG3MM; CREATED BY: CADPRO, SAN DIEGO, CA  (619) 552-1475
Z1 = MMSZ5222BT1G: Zener Diode; Manufacturer_Name: onsemi; Datasheet Link: http://www.onsemi.com/pub/Collateral/MMSZ5221BT1-D.PDF; Height: 1.35mm; Manufacturer_Part_Number: MMSZ5222BT1G; Mouser Part Number: 863-MMSZ5222BT1G; Mouser Price/Stock: https://www.mouser.co.uk/ProductDetail/onsemi/MMSZ5222BT1G?qs=P4IOph%252Bbot8Fquvz%2FRRevw%3D%3D; Arrow Part Number: MMSZ5222BT1G; Arrow Price/Stock: https://www.arrow.com/en/products/mmsz5222bt1g/on-semiconductor?region=nac

## Sheet PI_INTERFACE.SchDoc: Laser PCB
size A3; DrawnBy: James Singleton; Organization: TMC Technology Ltd.; DocumentNumber: 6; Revision: A; SheetNumber: 6; SheetTotal: 18; Drawn Date: 22/12/2020
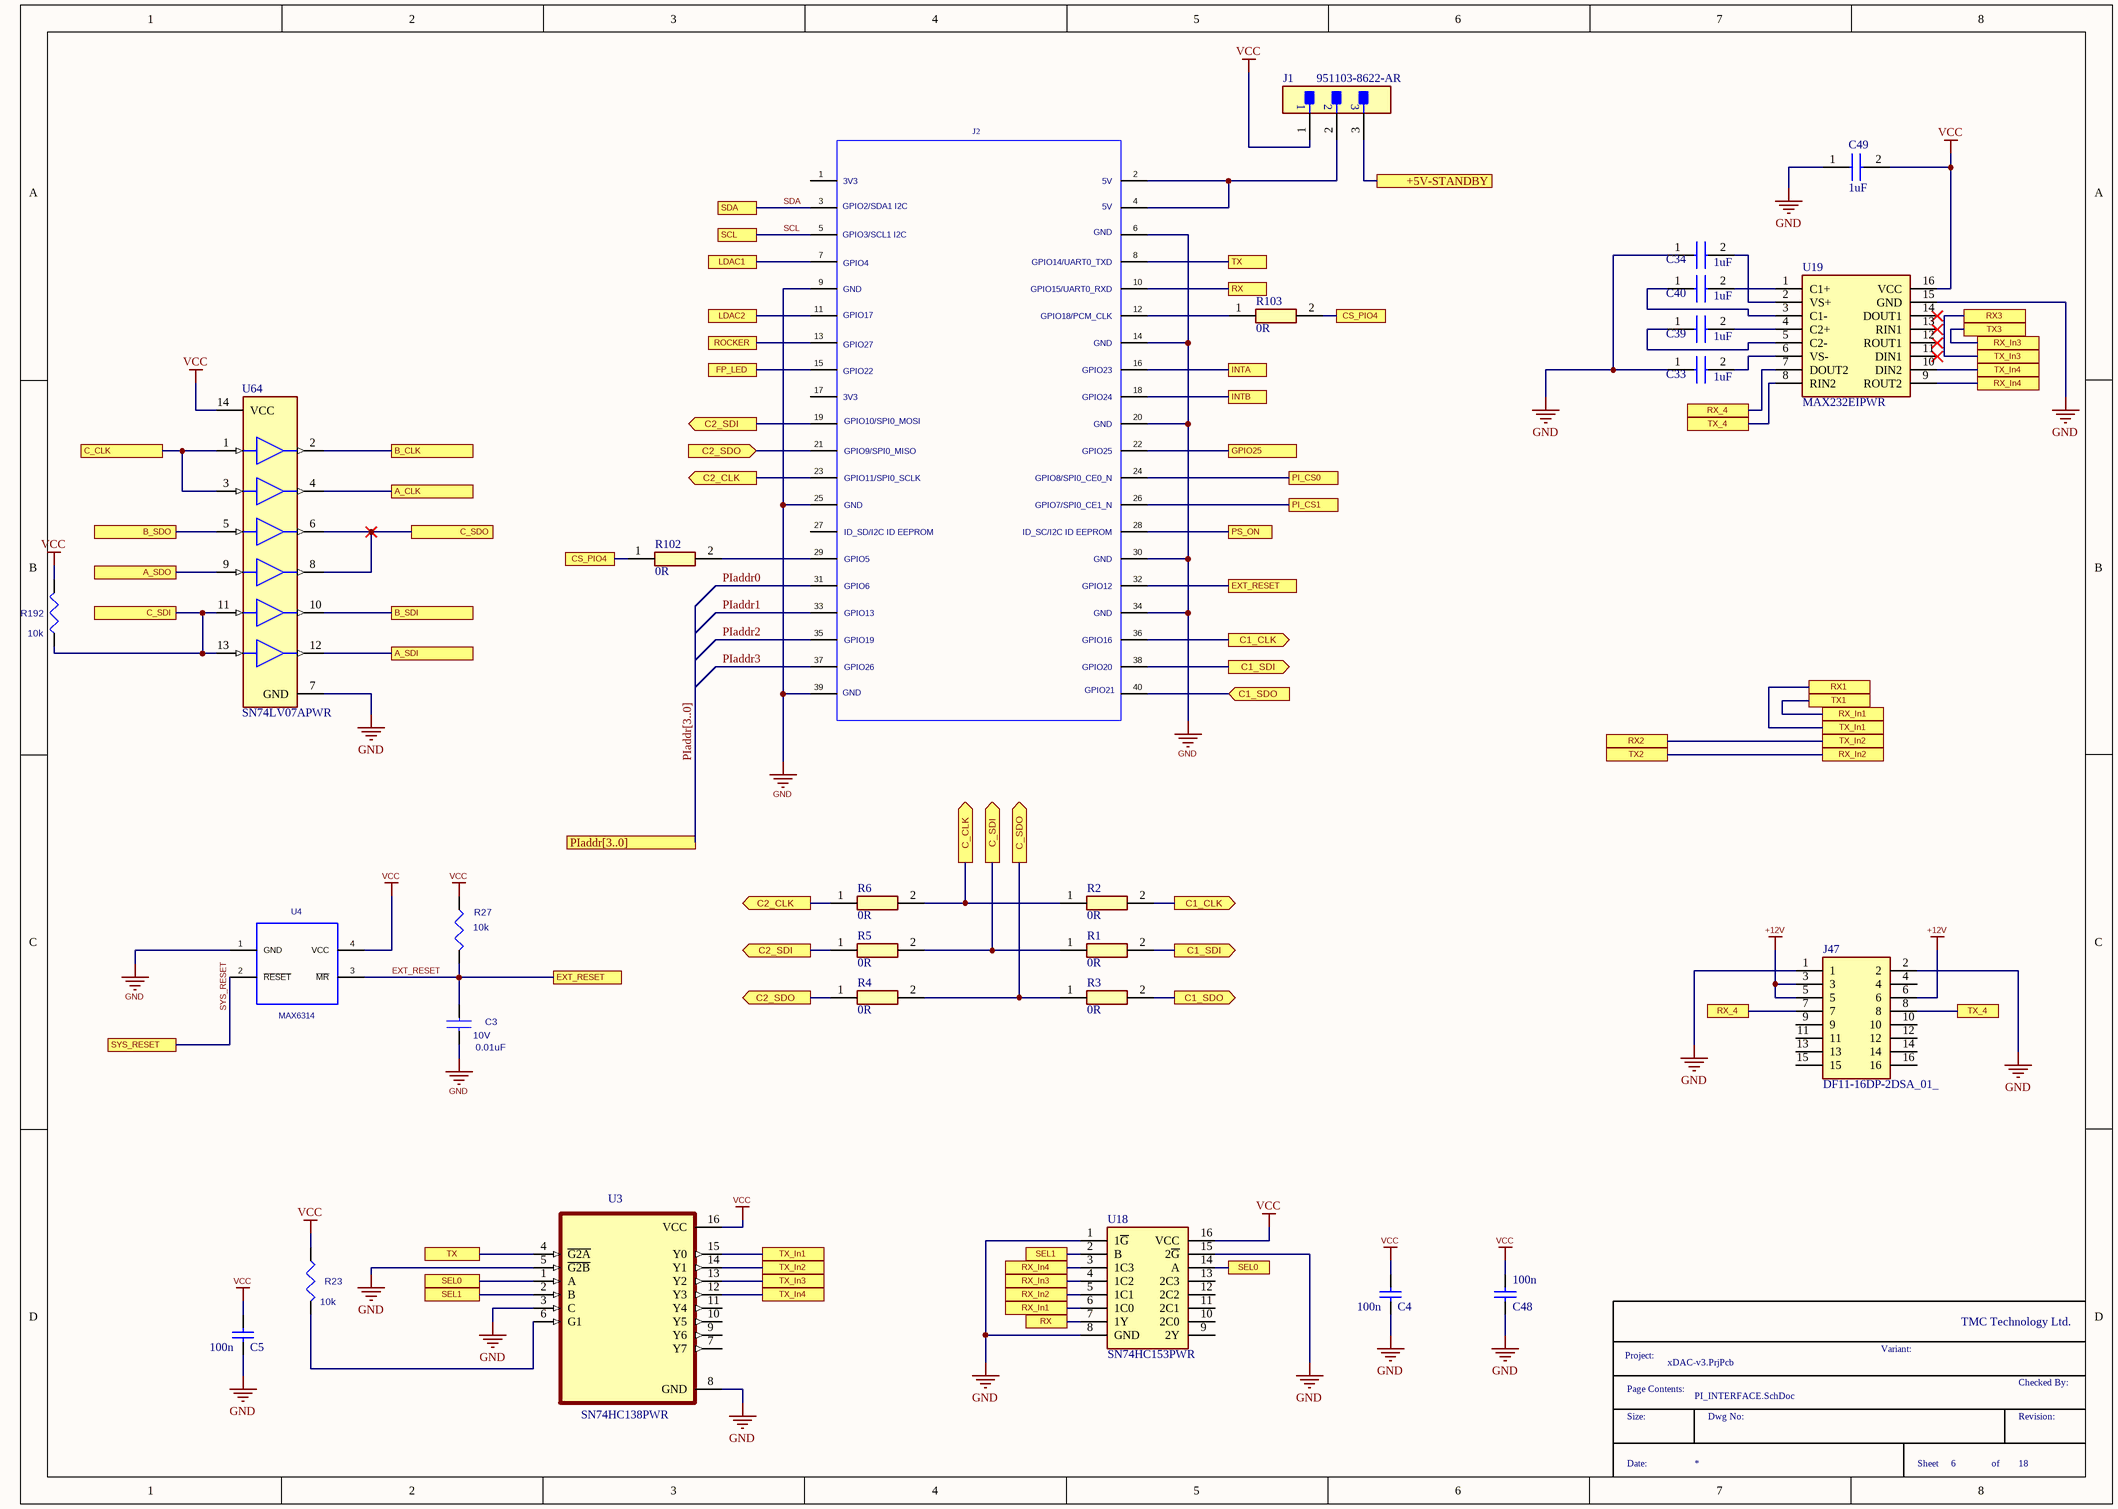
[diagram p6: PI_INTERFACE.SchDoc]

### Parts
C3  value 0.01uF  Rated_Voltage: 10V  [CC0603N]  (hidden comment: CAP)
C4  100n  [CAPC1608X90X35LL15T15]
C5  100n  [CAPC1608X90X35LL15T15]
C33  1uF  [CAPC1608X95N]
C34  1uF  [CAPC1608X95N]
C39  1uF  [CAPC1608X95N]
C40  1uF  [CAPC1608X95N]
C48  100n  [CAPC1608X90X35LL15T15]
C49  1uF  [CAPC1608X95N]
J1  951103-8622-AR  [FP-951103-8622-AR-MFG]
J2  RPI_PLUG  [HDRV40W64P254_2X20_5080X483X878P]  (value not drawn)
J47  DF11-16DP-2DSA_01_  [DF1116DP2DSA01]
R1  0R  [RESC1608X55N]
R2  0R  [RESC1608X55N]
R3  0R  [RESC1608X55N]
R4  0R  [RESC1608X55N]
R5  0R  [RESC1608X55N]
R6  0R  [RESC1608X55N]
R23  value 10k  [CR0603N]  (hidden comment: RES)
R27  value 10k  [CR0603N]  (hidden comment: RES)
R102  value 0R  [RESC1608X55N]  (hidden comment: RC0603FR-070RL)
R103  value 0R  [RESC1608X55N]  (hidden comment: RC0603FR-070RL)
R192  value 10k  [CR0603N]  (hidden comment: RES)
U3  SN74HC138PWR  [SOP65P640X120-16N]
U4  MAX6314  [SOT190P230X110-4N]
U18  SN74HC153PWR  [SOP65P640X120-16N]
U19  MAX232EIPWR  [SOP65P640X120-16N]
U64  SN74LV07APWR  [FP-PW0014A-IPC_B]

### Ports
+5V-STANDBY (see Power[6A]), A_CLK (see iDAC1[4A], iDAC2[4A], vDAC1[4A], vDAC2[4A]), A_SDI (see iDAC1[4A], iDAC2[4A], vDAC1[4A], vDAC2[4A]), A_SDO (see iDAC1[4A], iDAC2[4A], vDAC1[4A], vDAC2[4A]), B_CLK (see iDAC1[6A], iDAC2[6A], vDAC1[5A], vDAC2[5A]), B_SDI (see iDAC1[6A], iDAC2[6A], vDAC1[5A], vDAC2[5A]), B_SDO (see iDAC1[6A], iDAC2[6A], vDAC1[5A], vDAC2[5A]), C1_CLK (out, see PI_INTERFACE[5B]), C1_CLK (out, see PI_INTERFACE[5C]), C1_SDI (out, see PI_INTERFACE[5B]), C1_SDI (out, see PI_INTERFACE[5C]), C1_SDO (in, see PI_INTERFACE[5C]), C1_SDO (out, see PI_INTERFACE[5B]), C2_CLK (out, see PI_INTERFACE[3B]), C2_CLK (out, see PI_INTERFACE[3C]), C2_SDI (out, see PI_INTERFACE[3B]), C2_SDI (out, see PI_INTERFACE[3C]), C2_SDO (in, see PI_INTERFACE[3C]), C2_SDO (out, see PI_INTERFACE[3B]), C_CLK (out, see ChipSelects+Faults[4A], ChipSelects+Faults[4B], ChipSelects+Faults[4C], ChipSelects+Faults[4D], LIM+LEDS+POWER[8A], PI_INTERFACE[1B], PIO[3B], PIO[3D], PIO[6B], PIO[6C]), C_CLK (see ChipSelects+Faults[4A], ChipSelects+Faults[4B], ChipSelects+Faults[4C], ChipSelects+Faults[4D], LIM+LEDS+POWER[8A], PI_INTERFACE[4C], PIO[3B], PIO[3D], PIO[6B], PIO[6C]), C_SDI (out, see ChipSelects+Faults[4D], LIM+LEDS+POWER[8A], PI_INTERFACE[1B], PIO[3B], PIO[3D], PIO[6B], PIO[6C]), C_SDI (see ChipSelects+Faults[4D], LIM+LEDS+POWER[8A], PI_INTERFACE[4C], PIO[3B], PIO[3D], PIO[6B], PIO[6C]), C_SDO (out, see LIM+LEDS+POWER[6A], PI_INTERFACE[2B], PIO[3B], PIO[3D], PIO[6B], PIO[6C]), C_SDO (see LIM+LEDS+POWER[6A], PI_INTERFACE[4C], PIO[3B], PIO[3D], PIO[6B], PIO[6C]), CS_PIO4 (see PI_INTERFACE[3B], PIO[3D]), CS_PIO4 (see PI_INTERFACE[6A], PIO[3D]), EXT_RESET (see PI_INTERFACE[3C]), EXT_RESET (see PI_INTERFACE[5B]), FP_LED (see Fan & Power Out[7C]), GPIO25 (see Fan & Power Out[3D]), INTA (see PIO[5A], PIO[5D], PIO[7A], PIO[7C]), INTB (see PIO[5A], PIO[5D], PIO[7A], PIO[7C]), LDAC1 (see TEC_CONTROLLER_1[7A]), LDAC2 (see TEC_CONTROLLER_1[6B]), PI_CS0 (see ChipSelects+Faults[5B], ChipSelects+Faults[5C], ChipSelects+Faults[7A]), PI_CS1 (see ChipSelects+Faults[5A], ChipSelects+Faults[5C], ChipSelects+Faults[7A]), PIaddr[3..0] (see ChipSelects+Faults[4A], ChipSelects+Faults[4B], ChipSelects+Faults[4C], ChipSelects+Faults[7A]), PS_ON (see Power[7A]), ROCKER (see Fan & Power Out[2D]), RX1 (see PIO[1A]), RX2 (see PIO[1B]), RX3 (see PIO[1B]), RX (see PI_INTERFACE[4D]), RX (see PI_INTERFACE[5A]), RX_4 (see PI_INTERFACE[7B]), RX_4 (see PI_INTERFACE[7C]), RX_In1 (see PI_INTERFACE[4D]), RX_In1 (see PI_INTERFACE[7B]), RX_In2 (see PI_INTERFACE[4D]), RX_In2 (see PI_INTERFACE[7C]), RX_In3 (see PI_INTERFACE[4D]), RX_In3 (see PI_INTERFACE[8A]), RX_In4 (see PI_INTERFACE[4D]), RX_In4 (see PI_INTERFACE[8B]), SCL (see ADC-DAC[2C], ADC-DAC[3A], ADC-DAC[4B], ADC-DAC[4C], ADC-DAC[5C], ADC-DAC[6A], Fan & Power Out[6A], TEC_CONTROLLER_1[6B], TEC_CONTROLLER_1[7A], TEC_CONTROLLER_1[8B]), SDA (see ADC-DAC[2C], ADC-DAC[3A], ADC-DAC[4B], ADC-DAC[4C], ADC-DAC[5C], ADC-DAC[6A], Fan & Power Out[6A], TEC_CONTROLLER_1[6B], TEC_CONTROLLER_1[7A], TEC_CONTROLLER_1[7B]), SEL0 (see PI_INTERFACE[2D], PIO[5B]), SEL0 (see PI_INTERFACE[5D], PIO[5B]), SEL1 (see PI_INTERFACE[2D], PIO[5B]), SEL1 (see PI_INTERFACE[4D], PIO[5B]), SYS_RESET (see iDAC1[4A], iDAC1[6A], iDAC2[4A], iDAC2[6A], PIO[5A], PIO[5D], PIO[7B], PIO[7C], vDAC1[4A], vDAC1[5A], vDAC2[3A], vDAC2[5A]), TX1 (see PIO[2A]), TX2 (see PIO[2B]), TX3 (see PIO[2B]), TX (see PI_INTERFACE[2D]), TX (see PI_INTERFACE[5A]), TX_4 (see PI_INTERFACE[7B]), TX_4 (see PI_INTERFACE[8C]), TX_In1 (see PI_INTERFACE[3D]), TX_In1 (see PI_INTERFACE[7B]), TX_In2 (see PI_INTERFACE[3D]), TX_In2 (see PI_INTERFACE[7B]), TX_In3 (see PI_INTERFACE[3D]), TX_In3 (see PI_INTERFACE[8A]), TX_In4 (see PI_INTERFACE[3D]), TX_In4 (see PI_INTERFACE[8A])

### Nets
+12V: J47.3 J47.5 J47.6
GND: C3.2 C4.2 C5.2 C33.1 C34.1 C48.2 C49.1 J2.6 J2.9 J2.14 J2.20 J2.25 J2.30 J2.34 J2.39 J47.1 J47.2 U3.3(C) U3.5(~{G2B}) U3.8(GND) U4.1(GND) U18.1(1~{G}) U18.8(GND) U18.15(2~{G}) U19.15(GND) U64.7(GND)
VCC: C4.1 C5.1 C48.1 C49.2 J1.1 R23.1 R27.1 R192.1 U3.16(VCC) U4.4(VCC) U18.16(VCC) U19.16(VCC) U64.14(VCC)
+5V-STANDBY: J1.3 ; port +5V-STANDBY
A_CLK: U64.4(2Y) ; port A_CLK
A_SDI: U64.12(6Y) ; port A_SDI
A_SDO: U64.9(4A) ; port A_SDO
B_CLK: U64.2(1Y) ; port B_CLK
B_SDI: U64.10(5Y) ; port B_SDI
B_SDO: U64.5(3A) ; port B_SDO
C1_CLK: J2.36 R2.2 ; port C1_CLK
C1_SDI: J2.38 R1.2 ; port C1_SDI
C1_SDO: J2.40 R3.2 ; port C1_SDO
C2_CLK: J2.23 R6.1 ; port C2_CLK
C2_SDI: J2.19 R5.1 ; port C2_SDI
C2_SDO: J2.21 R4.1 ; port C2_SDO
C_CLK: R2.1 R6.2 U64.1(1A) U64.3(2A) ; port C_CLK
C_SDI: R1.1 R5.2 R192.2 U64.11(5A) U64.13(6A) ; port C_SDI
C_SDO: R3.1 R4.2 U64.6(3Y) U64.8(4Y) ; port C_SDO
CS_PIO4: R102.1 R103.2 ; port CS_PIO4
EXT_RESET: C3.1 J2.32 R27.2 U4.3(~{MR}) ; port EXT_RESET
FP_LED: J2.15 ; port FP_LED
GPIO25: J2.22 ; port GPIO25
INTA: J2.16 ; port INTA
INTB: J2.18 ; port INTB
LDAC1: J2.7 ; port LDAC1
LDAC2: J2.11 ; port LDAC2
PI_CS0: J2.24 ; port PI_CS0
PI_CS1: J2.26 ; port PI_CS1
PIaddr0: J2.31
PIaddr1: J2.33
PIaddr2: J2.35
PIaddr3: J2.37
PS_ON: J2.28 ; port PS_ON
ROCKER: J2.13 ; port ROCKER
RX: J2.10 U18.7(1Y) ; port RX
RX1: U3.15(Y0) ; port RX1, port TX_In1
RX2: U3.14(Y1) ; port TX_In2, port RX2
RX3: U3.13(Y2) ; port RX3, port TX_In3
RX_4: J47.7 U19.7(DOUT2) ; port RX_4
RX_In1: U18.6(1C0) ; port RX_In1, port TX1
RX_In2: U18.5(1C1) ; port RX_In2, port TX2
RX_In3: U18.4(1C2) ; port RX_In3, port TX3
RX_In4: U18.3(1C3) U19.9(ROUT2) ; port RX_In4
SCL: J2.5 ; port SCL
SDA: J2.3 ; port SDA
SEL0: U3.1(A) U18.14(A) ; port SEL0
SEL1: U3.2(B) U18.2(B) ; port SEL1
SYS_RESET: U4.2(~{RESET}) ; port SYS_RESET
TX: J2.8 U3.4(~{G2A}) ; port TX
TX_4: J47.8 U19.8(RIN2) ; port TX_4
TX_In4: U3.12(Y3) U19.10(DIN2) ; port TX_In4
NetC33_2: C33.2 U19.6(VS-)
NetC34_2: C34.2 U19.2(VS+)
NetC39_1: C39.1 U19.5(C2-)
NetC39_2: C39.2 U19.4(C2+)
NetC40_1: C40.1 U19.3(C1-)
NetC40_2: C40.2 U19.1(C1+)
NetJ1_2: J1.2 J2.2 J2.4
NetJ2_12: J2.12 R103.1
NetJ2_29: J2.29 R102.2
NetR23_2: R23.2 U3.6(G1)

Not connected (* = marked no-connect by the designer): J2 1 17 27; J47 4 9 10 11 12 13 14 15 16; U3 7(Y7) 9(Y6) 10(Y5) 11(Y4); U18 9(2Y) 10(2C0) 11(2C1) 12(2C2) 13(2C3); U19 11(DIN1)* 12(ROUT1)* 13(RIN1)* 14(DOUT1)*

### Buses and harness runs
bus PIaddr[3..0] = port PIaddr[3..0]

### Notes on the sheet
- TMC Technology Ltd.
- Page Contents:
- Project:
- Variant:
- Checked By:
- Size:
- Date:
- Dwg No:
- Sheet
- of
- Revision:
- (in symbol RPI_PLUG) 3V3; 5V; GPIO2/SDA1 I2C; GPIO3/SCL1 I2C; GND; GPIO4; GPIO14/UART0_TXD; GPIO15/UART0_RXD; GPIO17; GPIO18/PCM_CLK; GPIO27; GPIO22; GPIO23; GPIO24; GPIO10/SPI0_MOSI; GPIO9/SPI0_MISO; GPIO25; GPIO11/SPI0_SCLK; GPIO8/SPI0_CE0_N; GPIO7/SPI0_CE1_N; ID_SD/I2C ID EEPROM; ID_SC/I2C ID EEPROM; GPIO5; GPIO6; GPIO12; GPIO13; GPIO19; GPIO16; GPIO26; GPIO20; GPIO21

### Library data of the parts
C3 = CAP: CAP.,0.01uF,X5R,10V,10%,0603; Manufacturer_PN: 0603ZD103KAT2A; Manufacturer: AVX; CLASS: DISCRETE; FPLIST: CC0603N,CC0603L,CC0603M; Source_Path: \\MIL-NS1\CIP\SCHEMATIC_SYMBOLS\LTC_CAPACITOR.OLB; Geometry.Height: 37.40mil; Tolerance: 10%; Dielectric_Type: X5R; Package_Size: 0603; PCB DECAL: CC0603N
C4 C5 C48 = CMP-1035-02592-3: Chip Capacitor, 100 nF, +/- 10%, 50 V, -55 to 125 degC, 0603 (1608 Metric), RoHS, Tape and Reel; Manufacturer: KEMET; Manufacturer Part Number: C0603C104K5RACTU; Case\Package: 0603; Type (Capacitors): X7R; Capacitance: 100 nF; Voltage Rating: 50 V; Pins: 2; Max Operating Temperature: 125 degC; Min Operating Temperature: -55 degC; Case Code (Imperial): 0603; DatasheetVersion: 07/2016; Package Quantity: 4000; Length: 1.6 mm; REACH SVHC: No SVHC; Packaging: Tape and Reel; Case Code (Metric): 1608; Mounting Technology: Surface Mount; RoHSCompliant: true; Height: 0.9 mm; ComponentLink1URL: http://www.avx.com/; ComponentLink2URL: http://datasheets.avx.com/X7RDielectric.pdf; Mount: Surface Mount; ComponentLink2Description: Datasheet; Width: 0.81 mm; PackageReference: 0603; PackageDescription: 2-Pin Surface Mount Device, Body 1.6 x 0.81 mm; Radiation Hardening: No; ComponentLink1Description: Manufacturer URL; Voltage Rating (DC): 50 V; Tolerance: 10%; 8Vinv: *
C33 C34 C39 C40 C49 = CL10B105KB8NQNC: Capacitor; Manufacturer_Name: SAMSUNG; Datasheet Link: https://product.samsungsem.com/mlcc/CL10B105KB8NQN.do; Height: 0.95mm; Manufacturer_Part_Number: CL10B105KB8NQNC; Mouser Part Number: 187-CL10B105KB8NQNC; Mouser Price/Stock: https://www.mouser.co.uk/ProductDetail/Samsung-Electro-Mechanics/CL10B105KB8NQNC?qs=Jm2GQyTW%2FbjBq1uiSyA2AQ%3D%3D; Arrow Part Number: CL10B105KB8NQNC; Arrow Price/Stock: https://www.arrow.com/en/products/cl10b105kb8nqnc/samsung-electro-mechanics?region=europe
J1 = CMP-05379-000003-1: CONN HEADER VERT 3POS 2MM; Manufacturer: 3M; Conn Gender: Male; Current Rating: 2A; Number Of Contacts: 3; Conn Orientation: Straight; Height: 6.3mm; Digikey Description: CONN HEADER VERT 3POS 2MM; Device Class L3: unset; Category: Conn; Manufacturer Part Number: 951103-8622-AR; RoHS: TRUE; Contact Material: Gold,Nickel; ComponentLink2Description: Datasheet; Temperature Range Low: -55°C; Device Class L1: Connectors; Pitch: 2mm; Mouser Description: Header; PinStrip; CopperAlloy; HighTempThermoplastic; 3Cnts; 1A; RtAngle; 951Series; Octopart: https://octopart.com/951103-8622-ar-3m-14400669; Package: 951103-8622-AR; Lead Free: Yes; Device Class L2: Headers and Wire Housings; Temperature Range High: +125°C; ComponentLink2URL: http://multimedia.3m.com/mws/media/1400506O/3m-pin-strip-header-951-series-78-5100-2653-3.pdf; Automotive: No; Temperature: -55°C to +125°C; Number Of Rows: 1
J2 = RPI_PLUG: PCB Plug, Board-to-Board, 2.54 mm, 2 Rows, 40 Contacts, Through Hole Mount; Manufacturer: Multicomp; Part No: 2214S-40SG-85; PCB DECAL: RPI-RECEPTACLE-40; Order No: 2847248; System: Connector
J47 = DF11-16DP-2DSA_01_: Connector; Manufacturer_Name: Hirose; Manufacturer_Part_Number: DF11-16DP-2DSA(01); Datasheet Link: https://www.hirose.com/en/product/document?clcode=CL0543-0523-8-01&productname=DF11-16DP-2DSA(01)&series=DF11&documenttype=2DDrawing&lang=en&documentid=0000995343; Height: 7.1mm; Mouser Part Number: 798-DF11-16DP-2DSA01; Mouser Price/Stock: https://www.mouser.co.uk/ProductDetail/Hirose-Connector/DF11-16DP-2DSA01?qs=Ux3WWAnHpjAxqp0S3o8oHg%3D%3D; Arrow Part Number: DF11-16DP-2DSA(01); Arrow Price/Stock: https://www.arrow.com/en/products/df11-16dp-2dsa-01/hirose-electric
R1-R6 = RC0603FR-070RL: Resistor; Manufacturer_Name: YAGEO; Datasheet Link: https://componentsearchengine.com/Datasheets/2/RC0603FR-070RL.pdf; Height: 0.55mm; Manufacturer_Part_Number: RC0603FR-070RL; Mouser Part Number: 603-RC0603FR-070RL; Mouser Price/Stock: https://www.mouser.co.uk/ProductDetail/YAGEO/RC0603FR-070RL?qs=0yPvnVz5%2FmpDQv43TwvCfw%3D%3D; Arrow Part Number: RC0603FR-070RL; Arrow Price/Stock: https://www.arrow.com/en/products/rc0603fr-070rl/yageo?region=europe
R23 R27 R192 = RES: RES.,10k OHMS,1%,1/10W,0603; Manufacturer_PN: ERJ3EKF1002V; Manufacturer: PANASONIC; Part No: P10.0KHCT-ND; CLASS: DISCRETE; Temperature_Coefficient: 100ppm/C; FPLIST: CR0603N,CR0603L,CR0603M; Source_Path: \\MIL-NS1\CIP\SCHEMATIC_SYMBOLS\LTC_RESISTOR.OLB; Geometry.Height: 37.40mil; PCB DECAL: CR0603N; Rated_Power: 1/10W; Tolerance: 1%; Package_Size: 0603
R102 R103 = RC0603FR-070RL: Resistor; Manufacturer_Name: Yageo Group; Datasheet Link: http://www.yageo.com/documents/recent/PYu-RC0603_51_RoHS_L_v5.pdf; Height: 0.55mm; Manufacturer_Part_Number: RC0603FR-070RL; Mouser Part Number: 603-RC0603FR-070RL; Mouser Price/Stock: https://www.mouser.co.uk/ProductDetail/YAGEO/RC0603FR-070RL?qs=0yPvnVz5%2FmpDQv43TwvCfw%3D%3D; Arrow Part Number: RC0603FR-070RL; Arrow Price/Stock: https://www.arrow.com/en/products/rc0603fr-070rl/yageo?region=nac
U3 = SN74HC138PWR: 3-Line To 8-Line Decoders/Demultiplexers 16-TSSOP -40 to 85; MF: Texas Instruments; Purchase-URL: https://pricing.snapeda.com/search/part/SN74HC138PWR/?ref=eda; Package: TSSOP-16 Texas Instruments; MP: SN74HC138PWR; Value: *; SnapEDA_Link: https://www.snapeda.com/parts/SN74HC138PWR/Texas%20Instruments/view-part/387913/?ref=snap; Price: None; Availability: Unavailable; Check_prices: https://www.snapeda.com/parts/SN74HC138PWR/Texas%20Instruments/view-part/387913/?ref=eda
U4 = MAX6314: IC SUPERVISOR 1 CHANNEL SOT143-4; Manufacturer: Maxim; Part No: MAX6314US46D3+T; Geometry.Height: 1.1mm; Value: 4V63; Order No: 2512504; PCB DECAL: SOT190P230X110-4N
U18 = SN74HC153PWR: Integrated Circuit; Manufacturer_Name: Texas Instruments; Datasheet Link: http://www.ti.com/lit/gpn/sn74hc153; Height: 1.2mm; Manufacturer_Part_Number: SN74HC153PWR; Mouser Part Number: 595-SN74HC153PWR; Mouser Price/Stock: https://www.mouser.co.uk/ProductDetail/Texas-Instruments/SN74HC153PWR?qs=q81XD9WTF%252BI3umBBLdI3jQ%3D%3D; Arrow Part Number: SN74HC153PWR; Arrow Price/Stock: https://www.arrow.com/en/products/sn74hc153pwr/texas-instruments?region=nac
U19 = MAX232EIPWR: Integrated Circuit; Manufacturer_Name: Texas Instruments; Datasheet Link: http://www.ti.com/lit/gpn/max232e; Height: 1.2mm; Manufacturer_Part_Number: MAX232EIPWR; Mouser Part Number: 595-MAX232EIPWR; Mouser Price/Stock: https://www.mouser.co.uk/ProductDetail/Texas-Instruments/MAX232EIPWR?qs=iSMark9AYDUnm9LHXTJ2Sg%3D%3D; Arrow Part Number: MAX232EIPWR; Arrow Price/Stock: https://www.arrow.com/en/products/max232eipwr/texas-instruments?region=nac
U64 = CMP-0440-01103-4: IC BUF NON-INVERT 5.5V 14TSSOP; Logic Function: Buffer; Low Level Output Current: 16mA; Quiescent Current: 20uA; Propagation Delay: 7.5ns; Number of Channels: 6; Polarity: Non-Inverting; Turn-On Delay Time: 18ns; Number of Bits per Element: 1; High Level Output Current: -2uA; Min Supply Voltage: 2V; Height: 1.15mm; Width: 4.4mm; Contact Plating: Gold; Lead Free: Lead Free; Radiation Hardening: No; Technology: CMOS; Max Operating Temperature: 125°C; Packaging: Tape and Reel; Series: 74LV; Number of Output Lines: 6; RoHS Compliant: Yes; Number of Inputs: 6; Number of Gates: 6; Number of Outputs: 6; Mount: Surface Mount; Case/Package: TSSOP; Number of Bits: 6; Package Quantity: 2000; Max Supply Voltage: 5.5V; Number of Pins: 14; REACH SVHC: No SVHC; Number of Input Lines: 6; Number of Elements: 6; Min Operating Temperature: -40°C; Length: 5mm